# Altium schematic sheet EspCore.SchDoc
size A
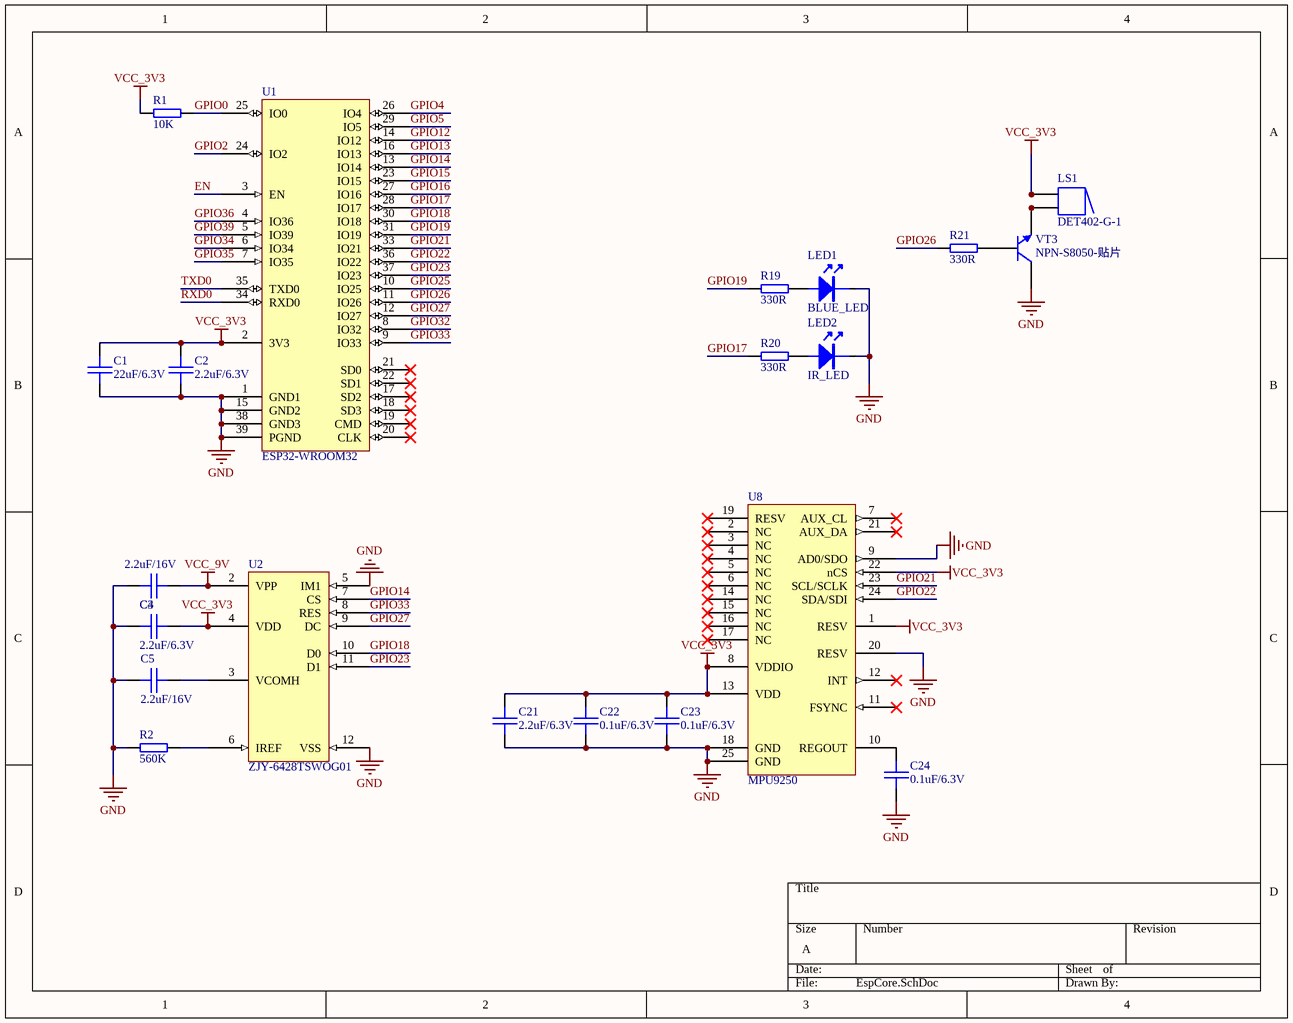
[diagram p0: EspCore.SchDoc]

## Parts
C1  22uF/6.3V  [SMT_C_0805]
C2  2.2uF/6.3V  [SMT_C_0402]
C3  2.2uF/6.3V  [SMT_C_0402]
C4  2.2uF/16V  [SMT_C_0603]
C5  2.2uF/16V  [SMT_C_0603]
C21  2.2uF/6.3V  [SMT_C_0402]
C22  0.1uF/6.3V  [SMT_C_0402]
C23  0.1uF/6.3V  [SMT_C_0402]
C24  0.1uF/6.3V  [SMT_C_0402]
LED1  BLUE_LED  [SMT_LED_0603]
LED2  IR_LED  [SMT_LED_0603]
LS1  DET402-G-1  [DET402-G-1]
R1  10K  [SMT_R_0402]
R2  560K  [SMT_R_0402]
R19  330R  [SMT_R_0402]
R20  330R  [SMT_R_0402]
R21  330R  [SMT_R_0402]
U1  ESP32-WROOM32  [ESP32-WROOM32]
U2  ZJY-6428TSWOG01  [ZJY_1.3_HZ_13Pin]
U8  MPU9250  [PQFN40P300X300X105_HS-25N]
VT3  NPN-S8050-贴片  [NPN-S8050-贴片]

## Nets
GND: C1.2 C2.1 C3.2 C4.1 C5.1 C21.1 C22.1 C23.1 C24.1 LED1.2(K) LED2.2(K) R2.2 U1.1(GND1) U1.15(GND2) U1.38(GND3) U1.39(PGND) U2.5(IM1) U2.12(VSS) U8.9(AD0/SDO) U8.18(GND) U8.20(RESV) U8.25(GND) VT3.3(C)
VCC_3V3: C1.1 C2.2 C3.1 C21.2 C22.2 C23.2 LS1.1 LS1.1A R1.2 U1.2(3V3) U2.4(VDD) U8.1(RESV) U8.8(VDDIO) U8.13(VDD) U8.22(nCS)
VCC_9V: C4.2 U2.2(VPP)
EN: U1.3(EN)
GPIO0: R1.1 U1.25(IO0)
GPIO2: U1.24(IO2)
GPIO4: U1.26(IO4)
GPIO5: U1.29(IO5)
GPIO12: U1.14(IO12)
GPIO13: U1.16(IO13)
GPIO14: U1.13(IO14) U2.7(CS)
GPIO15: U1.23(IO15)
GPIO16: U1.27(IO16)
GPIO17: R20.2 U1.28(IO17)
GPIO18: U1.30(IO18) U2.10(D0)
GPIO19: R19.2 U1.31(IO19)
GPIO21: U1.33(IO21) U8.23(SCL/SCLK)
GPIO22: U1.36(IO22) U8.24(SDA/SDI)
GPIO23: U1.37(IO23) U2.11(D1)
GPIO25: U1.10(IO25)
GPIO26: R21.2 U1.11(IO26)
GPIO27: U1.12(IO27) U2.9(DC)
GPIO32: U1.8(IO32)
GPIO33: U1.9(IO33) U2.8(RES)
GPIO34: U1.6(IO34)
GPIO35: U1.7(IO35)
GPIO36: U1.4(IO36)
GPIO39: U1.5(IO39)
RXD0: U1.34(RXD0)
TXD0: U1.35(TXD0)
NetC5_2: C5.2 U2.3(VCOMH)
NetC24_2: C24.2 U8.10(REGOUT)
NetLED1_1: LED1.1(A) R19.1
NetLED2_1: LED2.1(A) R20.1
NetLS1_2: LS1.2 LS1.2A VT3.2(E)
NetR2_1: R2.1 U2.6(IREF)
NetR21_1: R21.1 VT3.1(B)

Not connected (* = marked no-connect by the designer): U1 17(SD2)* 18(SD3)* 19(CMD)* 20(CLK)* 21(SD0)* 22(SD1)*; U8 2(NC)* 3(NC)* 4(NC)* 5(NC)* 6(NC)* 7(AUX_CL)* 11(FSYNC)* 12(INT)* 14(NC)* 15(NC)* 16(NC)* 17(NC)* 19(RESV)* 21(AUX_DA)*

## Library data of the parts
C1 = SMT_C_0805: Surface mount capacitor 0805
C2 C3 C21-C24 = SMT_C_0402: Surface mount capacitor 0402
C4 C5 = SMT_C_0603: Surface mount capacitor 0603
LED1 LED2 = SMT_LED_0603: SMT LED
LS1 = Buzzer: Published: 24-Mar-1999; LatestRevisionDate: 17-Dec-2003; LatestRevisionNote: Schematic revised, PCB Footprint replaced.; DatasheetVersion: 17-Dec-2003; PackageReference: ABSM-1574; Publisher: Altium Limited; PackageDescription: Magnetic Transducer Buzzer; ComponentLink1Description: Manufacturer Link; ComponentLink1URL: http://www.megastar.com/linecard/buzzmode/index.php
R1 R2 R19-R21 = SMT_R_0402: Surface mount resistor 0402